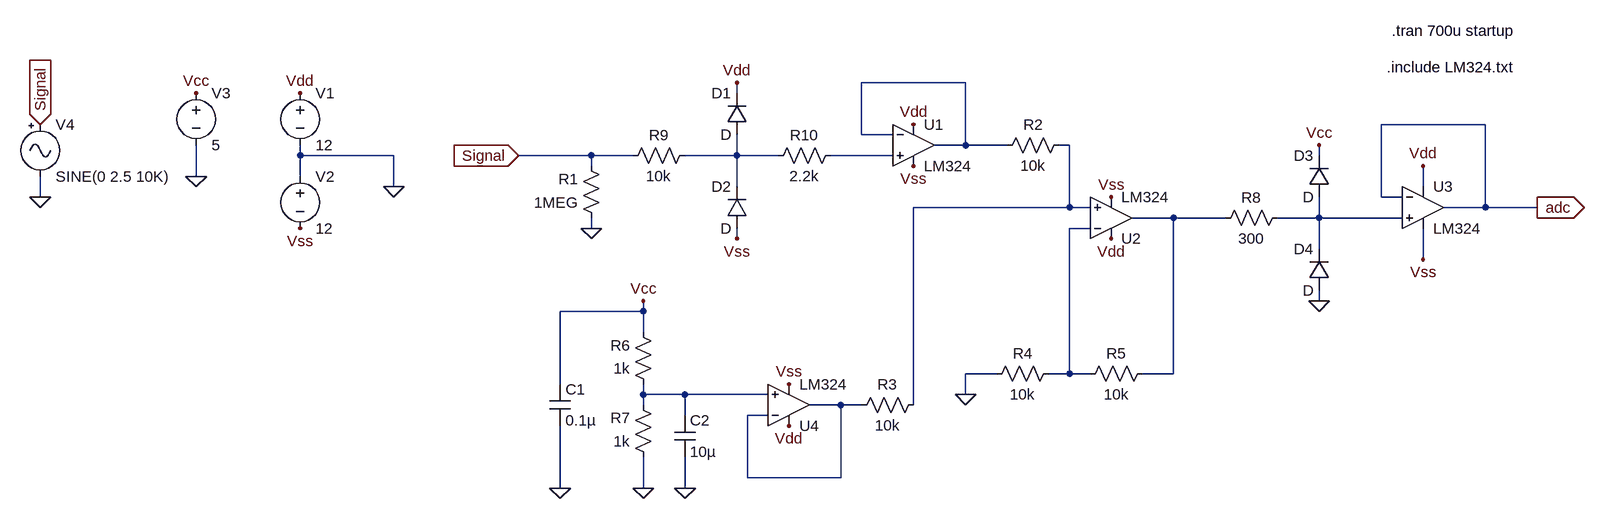
[diagram p0: schematic girino.asc]
girino.asc, the LTspice schematic file:
Version 4
SHEET 1 1304 1124
WIRE -192 32 -352 32
WIRE -544 48 -544 32
WIRE 608 96 448 96
WIRE -352 112 -352 32
WIRE -304 112 -352 112
WIRE -192 128 -192 32
WIRE -192 128 -240 128
WIRE -128 128 -192 128
WIRE -32 128 -48 128
WIRE -1216 144 -1216 128
WIRE -1072 144 -1216 144
WIRE -768 144 -880 144
WIRE -704 144 -768 144
WIRE -544 144 -544 112
WIRE -544 144 -624 144
WIRE -480 144 -544 144
WIRE -304 144 -400 144
WIRE 352 144 352 128
WIRE -768 160 -768 144
WIRE -1376 176 -1376 128
WIRE -1216 176 -1216 144
WIRE -1072 192 -1072 144
WIRE -544 192 -544 144
WIRE 512 192 512 160
WIRE -1616 208 -1616 176
WIRE 448 208 448 96
WIRE 480 208 448 208
WIRE -32 224 -32 128
WIRE -32 224 -272 224
WIRE 0 224 -32 224
WIRE 608 224 608 96
WIRE 608 224 544 224
WIRE 688 224 608 224
WIRE 128 240 64 240
WIRE 208 240 128 240
WIRE 352 240 352 208
WIRE 352 240 288 240
WIRE 480 240 352 240
WIRE -768 256 -768 240
WIRE 0 256 -32 256
WIRE -544 272 -544 256
WIRE 352 288 352 240
WIRE 512 304 512 256
WIRE 352 368 352 352
WIRE -688 384 -688 368
WIRE -688 384 -816 384
WIRE -688 416 -688 384
WIRE -144 480 -192 480
WIRE -32 480 -32 256
WIRE -32 480 -64 480
WIRE 0 480 -32 480
WIRE 128 480 128 240
WIRE 128 480 80 480
WIRE -816 496 -816 384
WIRE -688 512 -688 496
WIRE -624 512 -688 512
WIRE -496 512 -624 512
WIRE -192 512 -192 480
WIRE -688 528 -688 512
WIRE -384 528 -432 528
WIRE -352 528 -384 528
WIRE -272 528 -272 224
WIRE -624 544 -624 512
WIRE -496 544 -528 544
WIRE -528 640 -528 544
WIRE -384 640 -384 528
WIRE -384 640 -528 640
WIRE -816 656 -816 560
WIRE -688 656 -688 608
WIRE -624 656 -624 608
FLAG -272 96 Vdd
FLAG -272 160 Vss
FLAG 688 224 adc
IOPIN 688 224 Out
FLAG -880 144 Signal
IOPIN -880 144 In
FLAG -768 256 0
FLAG 32 272 Vdd
FLAG 32 208 Vss
FLAG -192 512 0
FLAG -688 656 0
FLAG -688 368 Vcc
FLAG -1072 192 0
FLAG -1216 48 Vdd
FLAG -1216 256 Vss
FLAG -1376 48 Vcc
FLAG -1376 176 0
FLAG -1616 208 0
FLAG -1616 96 Signal
IOPIN -1616 96 In
FLAG -544 32 Vdd
FLAG -544 272 Vss
FLAG -464 560 Vdd
FLAG -464 496 Vss
FLAG -816 656 0
FLAG 352 128 Vcc
FLAG 352 368 0
FLAG 512 160 Vdd
FLAG 512 304 Vss
FLAG -624 656 0
SYMBOL Opamps\\opamp2 -272 64 R0
SYMATTR InstName U1
SYMATTR Value LM324
SYMBOL res -752 256 R180
WINDOW 0 36 76 Left 2
WINDOW 3 36 40 Left 2
SYMATTR InstName R1
SYMATTR Value 1MEG
SYMBOL res -32 112 R90
WINDOW 0 0 56 VBottom 2
WINDOW 3 32 56 VTop 2
SYMATTR InstName R2
SYMATTR Value 10k
SYMBOL res -256 512 R90
WINDOW 0 0 56 VBottom 2
WINDOW 3 32 56 VTop 2
SYMATTR InstName R3
SYMATTR Value 10k
SYMBOL res -48 464 R90
WINDOW 0 0 56 VBottom 2
WINDOW 3 32 56 VTop 2
SYMATTR InstName R4
SYMATTR Value 10k
SYMBOL res 96 464 R90
WINDOW 0 0 56 VBottom 2
WINDOW 3 32 56 VTop 2
SYMATTR InstName R5
SYMATTR Value 10k
SYMBOL Opamps\\opamp2 32 304 M180
SYMATTR InstName U2
SYMATTR Value LM324
SYMBOL Opamps\\opamp2 512 160 R0
SYMATTR InstName U3
SYMATTR Value LM324
SYMBOL res -672 512 R180
WINDOW 0 36 76 Left 2
WINDOW 3 36 40 Left 2
SYMATTR InstName R6
SYMATTR Value 1k
SYMBOL res -672 624 R180
WINDOW 0 36 76 Left 2
WINDOW 3 36 40 Left 2
SYMATTR InstName R7
SYMATTR Value 1k
SYMBOL voltage -1216 32 R0
WINDOW 123 0 0 Left 2
WINDOW 39 0 0 Left 2
SYMATTR InstName V1
SYMATTR Value 12
SYMBOL voltage -1216 160 R0
WINDOW 123 0 0 Left 2
WINDOW 39 0 0 Left 2
SYMATTR InstName V2
SYMATTR Value 12
SYMBOL voltage -1376 32 R0
WINDOW 123 0 0 Left 2
WINDOW 39 0 0 Left 2
SYMATTR InstName V3
SYMATTR Value 5
SYMBOL Misc\\signal -1616 80 R0
SYMATTR InstName V4
SYMATTR Value SINE(0 2.5 10K)
SYMBOL res -608 128 R90
WINDOW 0 0 56 VBottom 2
WINDOW 3 32 56 VTop 2
SYMATTR InstName R9
SYMATTR Value 10k
SYMBOL res -384 128 R90
WINDOW 0 0 56 VBottom 2
WINDOW 3 32 56 VTop 2
SYMATTR InstName R10
SYMATTR Value 2.2k
SYMBOL diode -528 112 R180
WINDOW 0 24 64 Left 2
WINDOW 3 24 0 Left 2
SYMATTR InstName D1
SYMBOL diode -528 256 R180
WINDOW 0 24 64 Left 2
WINDOW 3 24 0 Left 2
SYMATTR InstName D2
SYMBOL Opamps\\opamp2 -464 592 M180
SYMATTR InstName U4
SYMATTR Value LM324
SYMBOL cap -832 496 R0
SYMATTR InstName C1
SYMATTR Value 0.1µ
SYMBOL res 304 224 R90
WINDOW 0 0 56 VBottom 2
WINDOW 3 32 56 VTop 2
SYMATTR InstName R8
SYMATTR Value 300
SYMBOL diode 368 208 R180
WINDOW 0 24 64 Left 2
WINDOW 3 24 0 Left 2
SYMATTR InstName D3
SYMBOL diode 368 352 R180
WINDOW 0 24 64 Left 2
WINDOW 3 24 0 Left 2
SYMATTR InstName D4
SYMBOL cap -640 544 R0
SYMATTR InstName C2
SYMATTR Value 10µ
TEXT 456 8 Left 2 !.include LM324.txt
TEXT 464 -48 Left 2 !.tran 700u startup

The netlist it stands for:
* girino.asc
XU1 N004 N001 Vdd Vss N001 LM324  ; pins In+ In- V+ V- OUT
R1 0 Signal 1MEG
R2 N002 N001 10k
R3 N002 N009 10k
R4 N007 0 10k
R5 N005 N007 10k
XU2 N002 N007 Vdd Vss N005 LM324  ; pins In+ In- V+ V- OUT
XU3 N006 adc Vdd Vss adc LM324  ; pins In+ In- V+ V- OUT
R6 N008 Vcc 1k
R7 0 N008 1k
V1 Vdd 0 12
V2 0 Vss 12
V3 Vcc 0 5
V4 Signal 0 SINE(0 2.5 10K)
R9 N003 Signal 10k
R10 N004 N003 2.2k
D1 N003 Vdd D
D2 Vss N003 D
XU4 N008 N009 Vdd Vss N009 LM324  ; pins In+ In- V+ V- OUT
C1 Vcc 0 0.1µ
R8 N006 N005 300
D3 N006 Vcc D
D4 0 N006 D
C2 N008 0 10µ
.model D D
.lib standard.dio
.include LM324.txt
.tran 700u startup
.backanno
.end